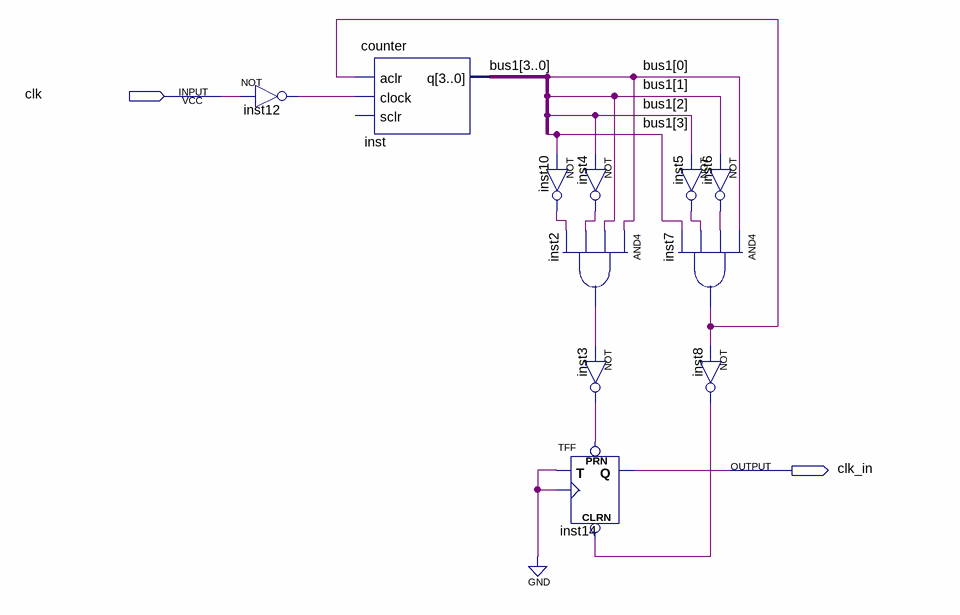
[diagram p0: schematic sheet]
// Quartus schematic Block1.bdf as structural Verilog: 11 symbols, 2 pins
module Block1 (
  input  clk,
  output clk_in
);

  wire inst2_out, inst3_out, inst4_out, inst5_out, inst6_out, inst7_out, inst8_out, inst10_out, inst12_out;
  wire [3:0] bus1;

  not inst12 (inst12_out, clk);
  counter inst (.aclr(inst7_out), .clock(inst12_out), .q(bus1));  // open: sclr
  not inst4 (inst4_out, bus1[2]);
  not inst10 (inst10_out, bus1[3]);
  and inst2 (inst2_out, bus1[0], bus1[1], inst4_out, inst10_out);
  not inst3 (inst3_out, inst2_out);
  TFF inst14 (.PRN(inst3_out), .CLRN(inst8_out), .T(1'b0), .CLK(1'b0), .Q(clk_in));
  not inst5 (inst5_out, bus1[2]);
  and inst7 (inst7_out, bus1[0], inst6_out, inst5_out, bus1[3]);
  not inst6 (inst6_out, bus1[1]);
  not inst8 (inst8_out, inst7_out);
endmodule
